# EAGLE design board (EAGLE 9.4.2)
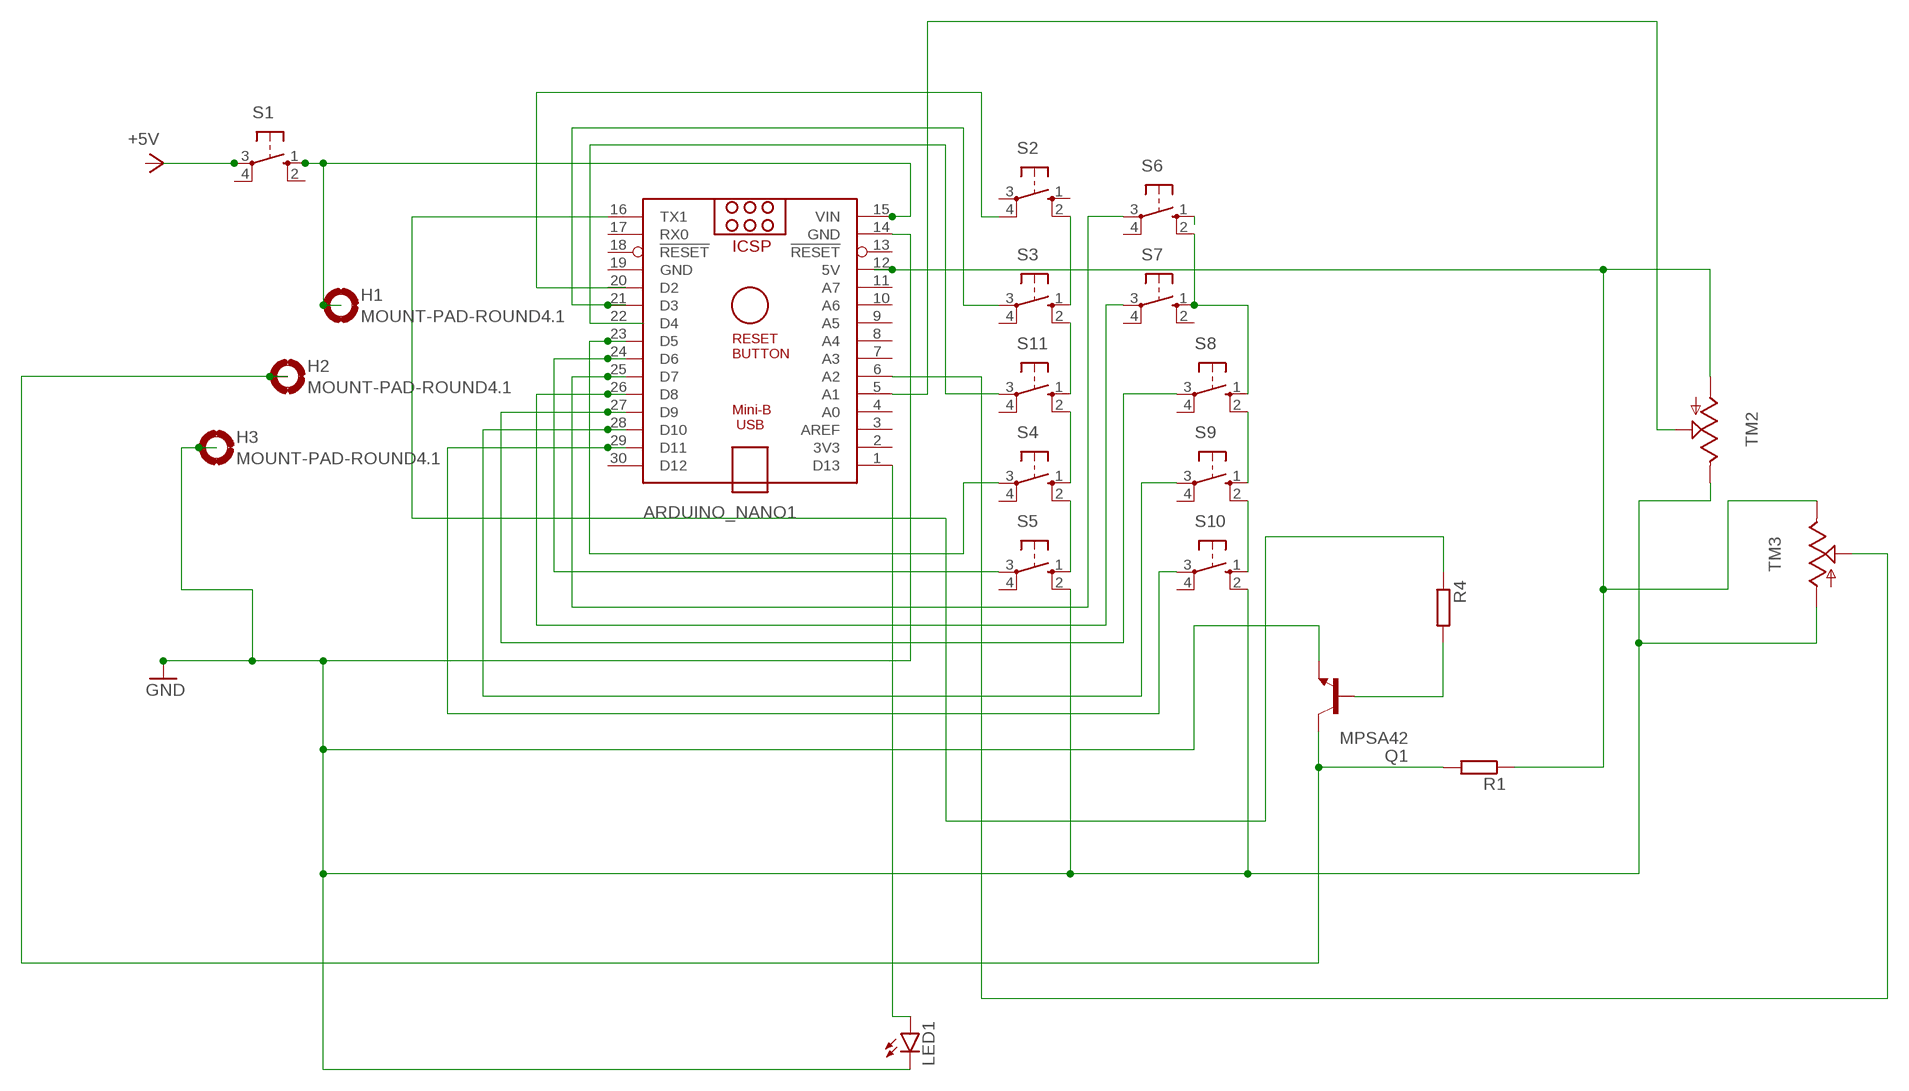
[diagram p0: schematic, sheet 1]

## Parts
ARDUINO_NANO1  ARDUINO_NANO  [ARDUINO_NANO]
H1  MOUNT-PAD-ROUND4.1  [4,1-PAD]
H2  MOUNT-PAD-ROUND4.1  [4,1-PAD]
H3  MOUNT-PAD-ROUND4.1  [4,1-PAD]
LED1  LED5MM  [LED5MM]
Q1  MPSA42  [TO92]
R1  R-EU_0204/2V  [0204V]
R4  R-EU_0204/2V  [0204V]
S1  40-XX  [B3F-40XX]
S2  10-XX  [B3F-10XX]
S3  10-XX  [B3F-10XX]
S4  10-XX  [B3F-10XX]
S5  10-XX  [B3F-10XX]
S6  10-XX  [B3F-10XX]
S7  10-XX  [B3F-10XX]
S8  10-XX  [B3F-10XX]
S9  10-XX  [B3F-10XX]
S10  10-XX  [B3F-10XX]
S11  10-XX  [B3F-10XX]
TM2  TRIMSLIDE75  [SLIDEPOT-75]
TM3  TRIMSLIDE75  [SLIDEPOT-75]

## Nets
N$1: S1.3(P)
N$2: ARDUINO_NANO1.15(VIN) H1.B4,1(MOUNT) S1.1(S)
N$3: ARDUINO_NANO1.14(GND) H3.B4,1(MOUNT) LED1.K(C) Q1.3(E) S5.2(S1) S10.2(S1) TM2.B TM3.A ; supply symbol labelled GND
N$4: Q1.2(B) R4.2
N$5: ARDUINO_NANO1.21(D3) S3.3(P)
N$6: ARDUINO_NANO1.25(D7) S6.3(P)
N$7: ARDUINO_NANO1.23(D5) S4.3(P)
N$8: ARDUINO_NANO1.24(D6) S5.3(P)
N$9: ARDUINO_NANO1.26(D8) S7.3(P)
N$10: ARDUINO_NANO1.27(D9) S8.3(P)
N$11: ARDUINO_NANO1.28(D10) S9.3(P)
N$12: ARDUINO_NANO1.29(D11) S10.3(P)
N$13: ARDUINO_NANO1.20(D2) S2.4(P1)
N$14: ARDUINO_NANO1.22(D4) S11.3(P)
N$15: ARDUINO_NANO1.16(TX1) R4.1
N$16: H2.B4,1(MOUNT) Q1.1(C) R1.2
N$17: ARDUINO_NANO1.12(5V) R1.1 TM2.A TM3.B
N$18: ARDUINO_NANO1.5(A1) TM2.WIPER
N$19: ARDUINO_NANO1.6(A2) TM3.WIPER
N$20: S2.2(S1) S3.1(S)
N$21: S3.2(S1) S11.1(S)
N$22: S4.2(S1) S5.1(S)
N$23: S6.1(S)
N$24: S6.2(S1) S7.1(S) S8.1(S)
N$25: S8.2(S1) S9.1(S)
N$26: S9.2(S1) S10.1(S)
N$27: S4.1(S) S11.2(S1)
N$28: ARDUINO_NANO1.1(D13) LED1.A
Unconnected: ARDUINO_NANO1.2(3V3) ARDUINO_NANO1.3(AREF) ARDUINO_NANO1.4(A0) ARDUINO_NANO1.7(A3) ARDUINO_NANO1.8(A4) ARDUINO_NANO1.9(A5) ARDUINO_NANO1.10(A6) ARDUINO_NANO1.11(A7) ARDUINO_NANO1.13(!RESET) ARDUINO_NANO1.17(RX0) ARDUINO_NANO1.18(!RESET) ARDUINO_NANO1.30(D12) S1.2(S1) S1.4(P1) S2.1(S) S2.3(P) S3.4(P1) S4.4(P1) S5.4(P1) S6.4(P1) S7.2(S1) S7.4(P1) S8.4(P1) S9.4(P1) S10.4(P1) S11.4(P1)

## Power pins joined to a net without a drawn wire
N$3: ARDUINO_NANO1.19(GND)

## Library data of the parts
ARDUINO_NANO1 = ArduinoNanoV30:ARDUINO_NANO: Arduino Nano V3.0 Overview: The Arduino Nano is a small, complete, and breadboard-friendly board based on the ATmega328 (Arduino Nano 3.x) or ATmega168 (Arduino Nano 2.x). It has more or less the same functionality of the Arduino Duemilanove, but in a different package. It lacks only a DC power jack, and works with a Mini-B USB cable instead of a standard one. The Nano was designed and is being produced by Gravitech. Specifications: Microcontroller Atmel ATmega168 or ATmega328 Operating Voltage (logic level) 5 V Input Voltage (recommended) 7-12 V Input Voltage (limits) 6-20 V Digital I/O Pins 14 (of which 6 provide PWM output) Analog Input Pins 8 DC Current per I/O Pin 40 mA Flash Memory 16 KB (ATmega168) or 32 KB (ATmega328) of which 2 KB used by bootloader SRAM 1 KB (ATmega168) or 2 KB (ATmega328) EEPROM 512 bytes (ATmega168) or 1 KB (ATmega328) Clock Speed 16 MHz Dimensions 0.73" x 1.70" Length 45 mm Width 18 mm Weigth 5 g Power: The Arduino Nano can be powered via the Mini-B USB connection, 6-20V unregulated external power supply (pin 30), or 5V regulated external power supply (pin 27). The power source is automatically selected to the highest voltage source. Memory: The ATmega168 has 16 KB of flash memory for storing code (of which 2 KB is used for the bootloader); the ATmega328 has 32 KB, (also with 2 KB used for the bootloader). The ATmega168 has 1 KB of SRAM and 512 bytes of EEPROM (which can be read and written with the EEPROM library); the ATmega328 has 2 KB of SRAM and 1 KB of EEPROM. Input and Output: Each of the 14 digital pins on the Nano can be used as an input or output, using pinMode(), digitalWrite(), and digitalRead() functions. They operate at 5 volts. Each pin can provide or receive a maximum of 40 mA and has an internal pull-up resistor (disconnected by default) of 20-50 kOhms. In addition, some pins have specialized functions. Visit Arduino - ArduinoBoardNano <https://www.arduino.cc/en/Main/ArduinoBoardNano>
H1-H3 = holes:MOUNT-PAD-ROUND: MOUNTING PAD, round
LED1 = led:LED: LED OSRAM: - CHIPLED LG R971, LG N971, LY N971, LG Q971, LY Q971, LO R971, LY R971 LH N974, LH R974 LS Q976, LO Q976, LY Q976 LO Q996 - Hyper CHIPLED LW Q18S LB Q993, LB Q99A, LB R99A - SideLED LS A670, LO A670, LY A670, LG A670, LP A670 LB A673, LV A673, LT A673, LW A673 LH A674 LY A675 LS A676, LA A676, LO A676, LY A676, LW A676 LS A679, LY A679, LG A679 - Hyper Micro SIDELED® LS Y876, LA Y876, LO Y876, LY Y876 LT Y87S - SmartLED LW L88C, LW L88S LB L89C, LB L89S, LG L890 LS L89K, LO L89K, LY L89K LS L896, LA L896, LO L896, LY L896 - TOPLED LS T670, LO T670, LY T670, LG T670, LP T670 LSG T670, LSP T670, LSY T670, LOP T670, LYG T670 LG T671, LOG T671, LSG T671 LB T673, LV T673, LT T673, LW T673 LH T674 LS T676, LA T676, LO T676, LY T676, LB T676, LH T676, LSB T676, LW T676 LB T67C, LV T67C, LT T67C, LS T67K, LO T67K, LY T67K, LW E67C LS E67B, LA E67B, LO E67B, LY E67B, LB E67C, LV E67C, LT E67C LW T67C LS T679, LY T679, LG T679 LS T770, LO T770, LY T770, LG T770, LP T770 LB T773, LV T773, LT T773, LW T773 LH T774 LS E675, LA E675, LY E675, LS T675 LS T776, LA T776, LO T776, LY T776, LB T776 LHGB T686 LT T68C, LB T68C - Hyper Mini TOPLED® LB M676 - Mini TOPLED Santana® LG M470 LS M47K, LO M47K, LY M47K Source: http://www.osram.convergy.de LUXEON: - LUMILED® LXK2-PW12-R00, LXK2-PW12-S00, LXK2-PW14-U00, LXK2-PW14-V00 LXK2-PM12-R00, LXK2-PM12-S00, LXK2-PM14-U00 LXK2-PE12-Q00, LXK2-PE12-R00, LXK2-PE12-S00, LXK2-PE14-T00, LXK2-PE14-U00 LXK2-PB12-K00, LXK2-PB12-L00, LXK2-PB12-M00, LXK2-PB14-N00, LXK2-PB14-P00, LXK2-PB14-Q00 LXK2-PR12-L00, LXK2-PR12-M00, LXK2-PR14-Q00, LXK2-PR14-R00 LXK2-PD12-Q00, LXK2-PD12-R00, LXK2-PD12-S00 LXK2-PH12-R00, LXK2-PH12-S00 LXK2-PL12-P00, LXK2-PL12-Q00, LXK2-PL12-R00 Source: www.luxeon.com KINGBRIGHT: KA-3528ASYC Source: www.kingbright.com
Q1 = MPSA42:MPSA42: NPN TRANSISTOR; AVAILABILITY: Unavailable; DESCRIPTION: TRANSISTOR, NPN, TO-92; Transistor Type: Bipolar; Transistor Polarity: NPN; Collector-to-Emitter Breakdown Voltage: 3...; MF: Central Semiconductor; MP: MPSA42; PACKAGE: TO-92 Multicomp; PRICE: None
R1 R4 = rcl:R-EU_: RESISTOR, European symbol; SPICEPREFIX: R
S1 = switch-omron:40-XX: OMRON SWITCH; MF: OMRON COMPONENTS USA; MPN: B3F-4000; OC_FARNELL: 176434; OC_NEWARK: 36K3105
S2-S11 = switch-omron:10-XX: OMRON SWITCH; MPN: B3F-1000; OC_FARNELL: 176432; OC_NEWARK: 36M3542
TM2 TM3 = Bourns PTA series:TRIM: Sliding potentiometers Based on Adafruits (https://github.com/adafruit/Adafruit-Eagle-Library) 'TRIM' device. For Bourns PTA series and TT Electronics PSxx series potentiometers.

## Board
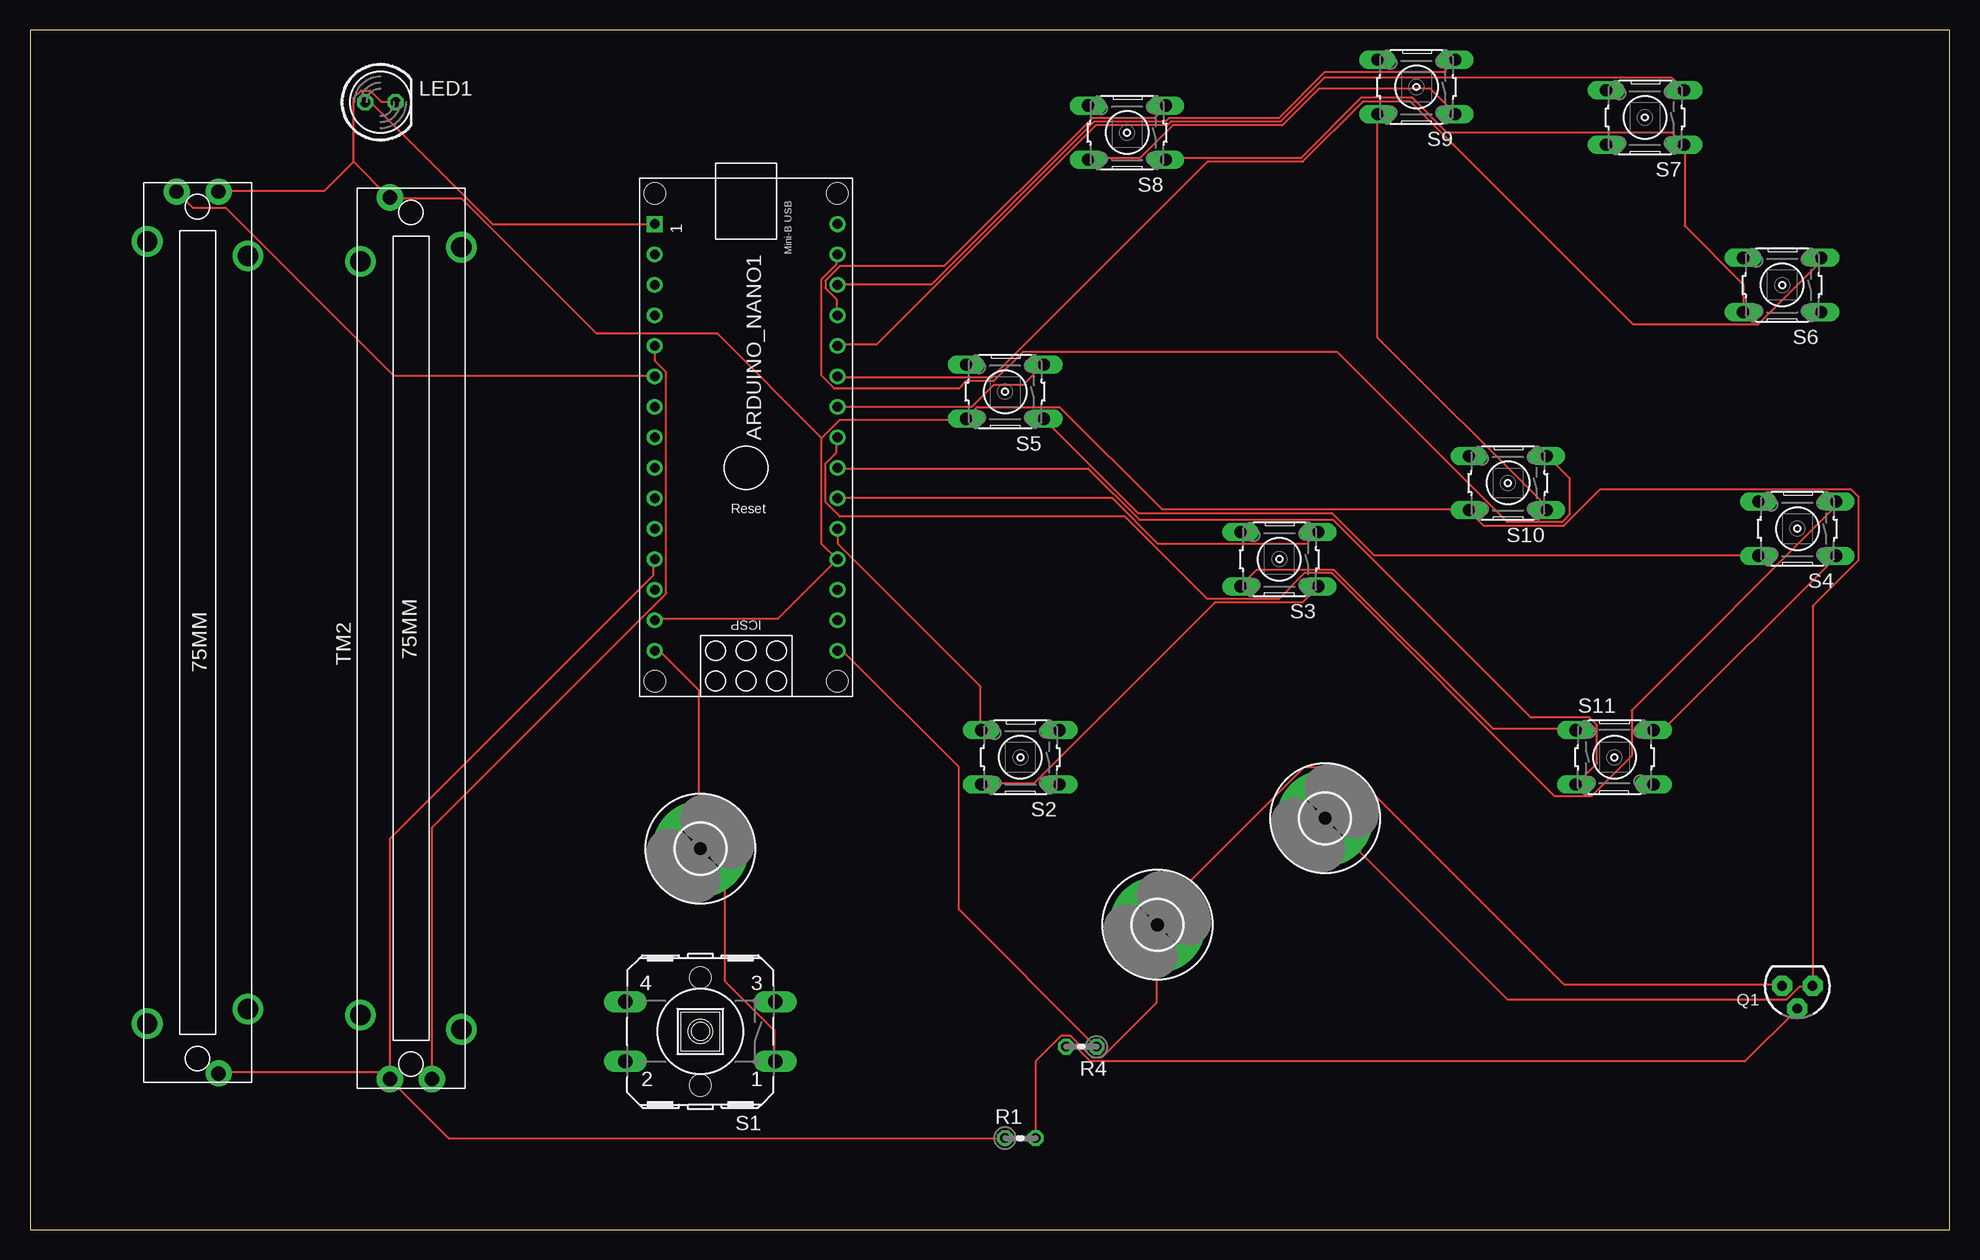
[diagram p1: board, top side]

Size 160 x 100 mm. Coordinates in mm from the lower left corner, seen from the top.
Outline: 0,0 160,0 160,100 0,100 0,0
Copper layers (1*16): Top 0.035mm / dielectric 1.5mm / Bottom 0.035mm
Design rules "default": minimum track width 6mil, minimum drill 0.35mm, track to track 6mil, track to pad 6mil, pad to pad 6mil, via to via 6mil, smd to smd 6mil, copper to edge 40mil, drill to drill 6mil, minimum pad ring 10mil, minimum via ring 8mil, stop-mask expansion 4mil, vias tented up to drill 0mil, thermal gap 10mil

### Footprints (pad centres in the part's own frame; a part is rotated, then mirrored left to right if it is on the bottom)
ARDUINO_NANO = drill 0.8 square: 1 -20.32,-7.62 | drill 0.8: 2 -17.78,-7.62; 3 -15.24,-7.62; 4 -12.7,-7.62; 5 -10.16,-7.62; 6 -7.62,-7.62; 7 -5.08,-7.62; 8 -2.54,-7.62; 9 0,-7.62; 10 2.54,-7.62; 11 5.08,-7.62; 12 7.62,-7.62; 13 10.16,-7.62; 14 12.7,-7.62; 15 15.24,-7.62; 16 15.24,7.62; 17 12.7,7.62; 18 10.16,7.62; 19 7.62,7.62; 20 5.08,7.62; 21 2.54,7.62; 22 0,7.62; 23 -2.54,7.62; 24 -5.08,7.62; 25 -7.62,7.62; 26 -10.16,7.62; 27 -12.7,7.62; 28 -15.24,7.62; 29 -17.78,7.62; 30 -20.32,7.62 | hole 1.778: -22.86,-7.62; -22.86,7.62; 17.78,7.62; 17.78,-7.62
4,1-PAD = drill 4.1 pad 8: B4,1 0,0
LED5MM = drill 0.813 octagon: A -1.27,0; K 1.27,0
TO92 = drill 0.813 pad 1.676 octagon: 1 1.27,0; 2 0,1.905; 3 -1.27,0
0204V = drill 0.813 octagon: 1 -1.27,0; 2 1.27,0
B3F-40XX = drill 1.194 long: 1 -6.248,2.489; 2 6.248,2.489; 3 -6.248,-2.489; 4 6.248,-2.489 | hole 1.803: 0,-4.496; 0,4.496
B3F-10XX = drill 1.016 long: 1 -3.251,2.261; 2 3.251,2.261; 3 -3.251,-2.261; 4 3.251,-2.261
SLIDEPOT-75 = drill 1.2 pad 2.184: A -36.99,1.75; B 36.514,1.75; WIPER -36.99,-1.75 | drill 1.7 pad 2.54: P$1 -31.64,4.2; P$2 31.164,4.2; P$3 -32.84,-4.2; P$4 32.364,-4.2

### Placement (x,y rotation side)
ARDUINO_NANO1  59.69,63.5 270 top
H1  55.88,31.75 180 top
H2  93.98,25.4 180 top
H3  107.95,34.29 180 top
LED1  29.21,93.98 0 top
Q1  147.32,20.32 180 top
R1  82.55,7.62 0 top
R4  87.63,15.24 180 top
S1  55.88,16.51 180 top
S2  82.55,39.37 180 top
S3  104.14,55.88 180 top
S4  147.32,58.42 180 top
S5  81.28,69.85 180 top
S6  146.05,78.74 180 top
S7  134.62,92.71 180 top
S8  91.44,91.44 180 top
S9  115.57,95.25 180 top
S10  123.19,62.23 180 top
S11  132.08,39.37 0 top
TM2  31.75,49.53 90 top
TM3  13.97,49.53 270 top

### Tracks (layer width: path | path; a pad name or v marks a point on that pad's centre or on a via)
N$2
  Top 0.152: ARDUINO_NANO1.15 52.12,48.16 52.58,48.16 55.78,44.96 55.78,31.85 H1.B4,1 57.91,29.72 57.91,20.73 62.03,16.61 62.03,14.02 S1.1
N$3
  Top 0.152: H3.B4,1 108.05,34.29 123.14,19.2 146.46,19.2 147.52,20.27 148.59,20.27 Q1.3 148.59,51.97 152.4,55.78 152.4,61.11 151.79,61.72 130.91,61.72 127.86,58.67 121.16,58.67 119.94,59.89 S10.2 119.94,60.05 94.34,60.05 85.8,68.58 78.94,68.58 78.03,67.67 S5.2 78.03,67.51 67.51,67.51 65.99,65.99 | 26.98,89 26.98,94.34 27.58,94.94 28.35,94.94 29.26,94.03 30.48,94.03 LED1.K | 26.98,89 29.87,86.11 TM2.B 30.02,85.95 35.97,85.95 47.24,74.68 57.3,74.68 65.99,65.99 | 26.98,89 24.54,86.56 15.85,86.56 TM3.A | ARDUINO_NANO1.14 52.12,50.9 62.33,50.9 ARDUINO_NANO1.19 67.21,55.93 65.99,57.15 65.99,65.99
N$4
  Top 0.152: R4.2 87.17,15.24 88.39,14.02 142.95,14.02 147.22,18.29 Q1.2
N$5
  Top 0.152: ARDUINO_NANO1.21 90.22,60.96 94.03,57.15 106.38,57.15 107.29,58.06 S3.3
N$6
  Top 0.152: ARDUINO_NANO1.25 67.36,71.02 80.16,71.02 98.15,89 106.07,89 111.1,94.03 115.06,94.03 133.66,75.44 144.02,75.44 149.2,80.62 149.2,80.92 S6.3
N$7
  Top 0.152: S4.3 150.57,60.35 133.5,43.28 133.5,39.47 130.15,36.12 127.1,36.12 108.51,54.71 106.22,54.71 104.09,52.58 98.15,52.58 91.29,59.44 67.51,59.44 66.29,60.66 66.29,63.86 67.21,64.77 67.21,65.99 ARDUINO_NANO1.23
N$8
  Top 0.152: ARDUINO_NANO1.24 78.49,68.58 80.31,70.41 82.75,70.41 84.43,72.08 S5.3
N$9
  Top 0.152: ARDUINO_NANO1.26 67.36,73.76 70.56,73.76 88.85,92.05 94.79,92.05 95.1,92.35 104.24,92.35 107.9,96.01 136.85,96.01 137.77,95.1 S7.3
N$10
  Top 0.152: ARDUINO_NANO1.27 67.21,76.2 67.21,77.57 66.29,78.49 66.29,79.1 67.51,80.31 76.2,80.31 88.54,92.66 93.73,92.66 94.64,93.57 S8.3
N$11
  Top 0.152: ARDUINO_NANO1.28 67.36,78.79 75.13,78.79 88.7,92.35 94.64,92.35 94.94,92.66 104.09,92.66 107.9,96.47 117.81,96.47 118.72,97.38 S9.3
N$12
  Top 0.152: ARDUINO_NANO1.29 67.21,81.23 67.21,80.47 65.99,79.25 65.99,71.17 67.06,70.1 77.42,70.1 78.03,70.71 80.31,70.71 82.75,73.15 108.97,73.15 123.14,58.98 127.71,58.98 128.32,59.59 128.32,62.64 126.49,64.47 S10.3
N$13
  Top 0.152: ARDUINO_NANO1.20 67.36,58.37 67.36,57.15 79.25,45.26 79.25,41.76 S2.4
N$14
  Top 0.152: ARDUINO_NANO1.22 67.36,63.4 88.24,63.4 92.51,59.13 108.66,59.13 125.12,42.67 130,42.67 130.61,42.06 130.61,38.86 128.93,37.19 S11.3
N$15
  Top 0.152: ARDUINO_NANO1.16 67.36,48.16 67.82,48.16 77.42,38.56 77.42,26.67 88.85,15.24 R4.1
N$16
  Top 0.152: R1.2 83.82,14.02 85.95,16.15 86.72,16.15 88.54,14.33 89.31,14.33 93.88,18.9 93.88,25.3 H2.B4,1 94.03,25.45 94.03,26.36 106.22,38.56 109.73,38.56 127.86,20.42 146,20.42 Q1.1
N$17
  Top 0.152: 30.02,13.11 30.02,12.65 TM2.A | 30.02,13.11 30.02,32.61 51.97,54.56 51.97,55.78 ARDUINO_NANO1.12 | R1.1 34.9,7.62 30.02,12.5 TM2.A | 30.02,13.11 15.85,13.11 TM3.B | 30.02,13.11 TM2.A
N$18
  Top 0.152: ARDUINO_NANO1.5 52.12,73.61 52.12,72.39 53.03,71.48 53.03,53.03 33.53,33.53 33.53,12.65 TM2.WIPER
N$19
  Top 0.152: ARDUINO_NANO1.6 51.97,71.17 30.33,71.17 16.31,85.19 13.56,85.19 12.34,86.41 TM3.WIPER
N$20
  Top 0.152: S2.2 79.4,37.19 83.67,37.19 98.75,52.27 106.07,52.27 107.29,53.49 S3.1
N$21
  Top 0.152: S11.1 128.78,41.76 121.92,41.76 108.66,55.02 102.26,55.02 100.89,53.65 S3.2
N$22
  Top 0.152: S4.2 144.02,56.24 112.01,56.24 108.51,59.74 92.35,59.74 84.58,67.51 S5.1
N$24
  Top 0.152: S6.2 142.8,78.79 137.92,83.67 137.92,90.37 S7.1 137.77,90.53 136.85,91.44 118.11,91.44 115.21,94.34 110.95,94.34 105.92,89.31 94.79,89.31 S8.1
N$25
  Top 0.152: S8.2 88.24,89.31 92.51,89.31 95.25,92.05 104.39,92.05 107.44,95.1 116.74,95.1 118.72,93.12 S9.1
N$26
  Top 0.152: S9.2 112.32,74.37 126.34,60.35 126.34,60.05 S10.1
N$27
  Top 0.152: S11.2 135.33,41.76 136.25,41.76 150.57,56.08 S4.1
N$28
  Top 0.152: ARDUINO_NANO1.1 38.56,83.82 28.5,93.88 28.04,93.88 LED1.A